# Altium schematic sheet ESP32_AC_Controller.SchDoc
size A3; SheetNumber: 1; SheetTotal: 1
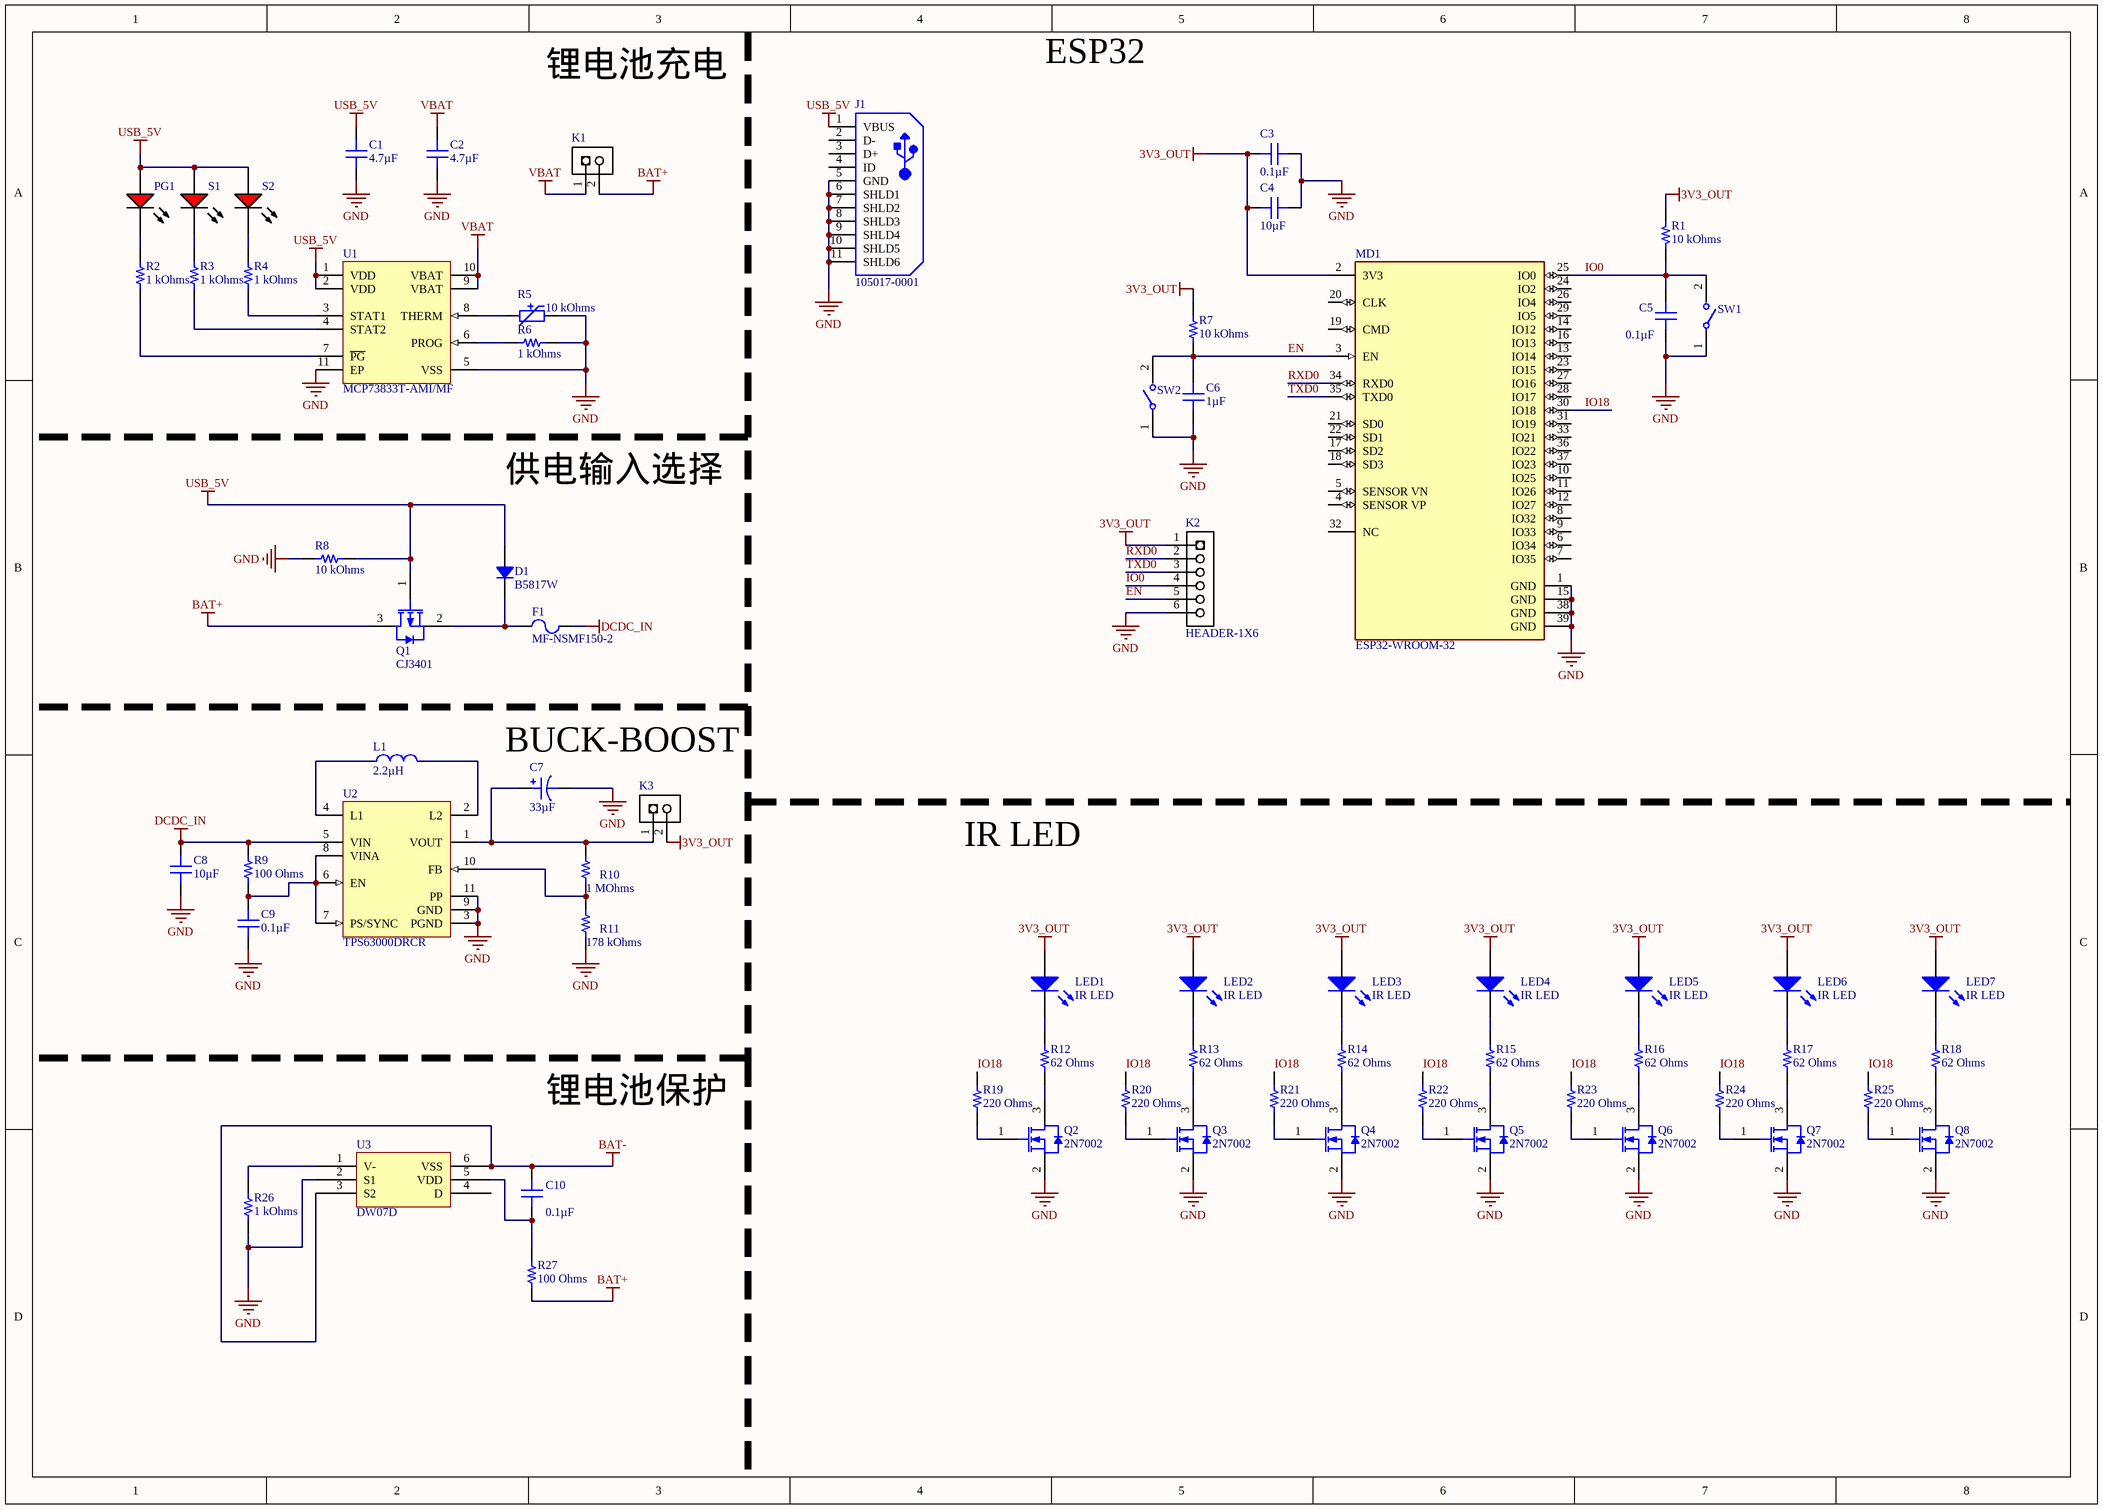
[diagram p0: ESP32_AC_Controller.SchDoc]

## Parts
C1  4.7µF  [CAP 0603_1608]
C2  4.7µF  [CAP 0603_1608]
C3  0.1µF  [CAP 0603_1608]
C4  10µF  [CAP 0603_1608]
C5  0.1µF  [CAP 0603_1608]
C6  1µF  [CAP 0603_1608]
C7  33µF  [CAP POL 1411_3528]
C8  10µF  [CAP 0603_1608]
C9  0.1µF  [CAP 0603_1608]
C10  0.1µF  [CAP 0603_1608]
D1  B5817W  [SOD-123]
F1  MF-NSMF150-2  [BOUR-MF-NSMF150-2_V]
J1  105017-0001  [USB-MICRO-B_V]
K1  HEADER-1X2  [HEADER-1X2]  (value not drawn)
K2  HEADER-1X6  [HEADER-1X6]
K3  HEADER-1X2  [HEADER-1X2]  (value not drawn)
L1  2.2µH  [FP-IHLP-2525CZ-FP_2_413x3-MFG]
LED1  IR LED  [Type 5mm]
LED2  IR LED  [Type 5mm]
LED3  IR LED  [Type 5mm]
LED4  IR LED  [Type 5mm]
LED5  IR LED  [Type 5mm]
LED6  IR LED  [Type 5mm]
LED7  IR LED  [Type 5mm]
MD1  ESP32-WROOM-32  [FP-ESP32-WROOM-32-MFG]
PG1  TLMS1100-GS08  [VISH-TLMX1100_V]  (value not drawn)
Q1  CJ3401  [FAIR-SSOT3L-3_V]
Q2  2N7002  [STM-SOT-23-3_V]
Q3  2N7002  [STM-SOT-23-3_V]
Q4  2N7002  [STM-SOT-23-3_V]
Q5  2N7002  [STM-SOT-23-3_V]
Q6  2N7002  [STM-SOT-23-3_V]
Q7  2N7002  [STM-SOT-23-3_V]
Q8  2N7002  [STM-SOT-23-3_V]
R1  10 kOhms  [RES 0603_1608]
R2  1 kOhms  [RES 0603_1608]
R3  1 kOhms  [RES 0603_1608]
R4  1 kOhms  [RES 0603_1608]
R5  10 kOhms  [PTC 0603_1608]
R6  1 kOhms  [RES 0603_1608]
R7  10 kOhms  [RES 0603_1608]
R8  10 kOhms  [RES 0603_1608]
R9  100 Ohms  [RES 0603_1608]
R10  1 MOhms  [RES 0603_1608]
R11  178 kOhms  [RES 0603_1608]
R12  62 Ohms  [RES 0603_1608]
R13  62 Ohms  [RES 0603_1608]
R14  62 Ohms  [RES 0603_1608]
R15  62 Ohms  [RES 0603_1608]
R16  62 Ohms  [RES 0603_1608]
R17  62 Ohms  [RES 0603_1608]
R18  62 Ohms  [RES 0603_1608]
R19  220 Ohms  [RES 0603_1608]
R20  220 Ohms  [RES 0603_1608]
R21  220 Ohms  [RES 0603_1608]
R22  220 Ohms  [RES 0603_1608]
R23  220 Ohms  [RES 0603_1608]
R24  220 Ohms  [RES 0603_1608]
R25  220 Ohms  [RES 0603_1608]
R26  1 kOhms  [RES 0603_1608]
R27  100 Ohms  [RES 0603_1608]
S1  TLMS1100-GS08  [VISH-TLMX1100_V]  (value not drawn)
S2  TLMS1100-GS08  [VISH-TLMX1100_V]  (value not drawn)
SW1  B3U-1000P  [FP-B3U-1000P-MFG]  (value not drawn)
SW2  B3U-1000P  [FP-B3U-1000P-MFG]  (value not drawn)
U1  MCP73833T-AMI/MF  [DFN-MF10]
U2  TPS63000DRCR  [DRC0010J_V]
U3  DW07D  [DW07D]

## Nets
3V3_OUT: C3.2 C4.1 K2.1 K3.2 LED1.2(A) LED2.2(A) LED3.2(A) LED4.2(A) LED5.2(A) LED6.2(A) LED7.2(A) MD1.2(3V3) R1.2 R7.2
BAT+: K1.2 Q1.3(DRAIN) R27.1
BAT-: C10.1 U3.3(S2) U3.6(VSS)
DCDC_IN: C8.2 F1.2 R9.1 U2.5(VIN)
GND: C1.1 C2.1 C3.1 C4.2 C5.2 C6.1 C7.2 C8.1 C9.2 J1.5(GND) J1.6(SHLD1) J1.7(SHLD2) J1.8(SHLD3) J1.9(SHLD4) J1.10(SHLD5) J1.11(SHLD6) K2.6 MD1.1(GND) MD1.15(GND) MD1.38(GND) MD1.39(GND) Q2.2(S) Q3.2(S) Q4.2(S) Q5.2(S) Q6.2(S) Q7.2(S) Q8.2(S) R5.1 R6.1 R8.2 R11.2 R26.1 SW1.1 SW2.1 U1.5(VSS) U1.11(EP) U2.3(PGND) U2.9(GND) U2.11(PP) U3.2(S1)
USB_5V: C1.2 D1.1 J1.1(VBUS) PG1.1(A) Q1.1(GATE) R8.1 S1.1(A) S2.1(A) U1.1(VDD) U1.2(VDD)
VBAT: C2.2 K1.1 U1.9(VBAT) U1.10(VBAT)
EN: C6.2 K2.5 MD1.3(EN) R7.1 SW2.2
IO0: C5.1 K2.4 MD1.25(IO0) R1.1 SW1.2
IO18: MD1.30(IO18) R19.2 R20.2 R21.2 R22.2 R23.2 R24.2 R25.2
RXD0: K2.2 MD1.34(RXD0)
TXD0: K2.3 MD1.35(TXD0)
NetC7_1: C7.1 K3.1 R10.1 U2.1(VOUT)
NetC9_1: C9.1 R9.2 U2.6(EN) U2.7(PS/SYNC) U2.8(VINA)
NetC10_2: C10.2 R27.2 U3.5(VDD)
NetD1_2: D1.2 F1.1 Q1.2(SOURCE)
NetL1_1: L1.1 U2.4(L1)
NetL1_2: L1.2 U2.2(L2)
NetLED1_1: LED1.1(K) R12.2
NetLED2_1: LED2.1(K) R13.2
NetLED3_1: LED3.1(K) R14.2
NetLED4_1: LED4.1(K) R15.2
NetLED5_1: LED5.1(K) R16.2
NetLED6_1: LED6.1(K) R17.2
NetLED7_1: LED7.1(K) R18.2
NetPG1_2: PG1.2(K) R2.2
NetQ2_1: Q2.1(G) R19.1
NetQ2_3: Q2.3(D) R12.1
NetQ3_1: Q3.1(G) R20.1
NetQ3_3: Q3.3(D) R13.1
NetQ4_1: Q4.1(G) R21.1
NetQ4_3: Q4.3(D) R14.1
NetQ5_1: Q5.1(G) R22.1
NetQ5_3: Q5.3(D) R15.1
NetQ6_1: Q6.1(G) R23.1
NetQ6_3: Q6.3(D) R16.1
NetQ7_1: Q7.1(G) R24.1
NetQ7_3: Q7.3(D) R17.1
NetQ8_1: Q8.1(G) R25.1
NetQ8_3: Q8.3(D) R18.1
NetR2_1: R2.1 U1.7(~{PG})
NetR3_1: R3.1 U1.4(STAT2)
NetR3_2: R3.2 S1.2(K)
NetR4_1: R4.1 U1.3(STAT1)
NetR4_2: R4.2 S2.2(K)
NetR5_2: R5.2 U1.8(THERM)
NetR6_2: R6.2 U1.6(PROG)
NetR10_2: R10.2 R11.1 U2.10(FB)
NetR26_2: R26.2 U3.1(V-)

Not connected (* = marked no-connect by the designer): J1 2(D-) 3(D+) 4(ID); MD1 4(SENSOR_VP) 5(SENSOR_VN) 6(IO34) 7(IO35) 8(IO32) 9(IO33) 10(IO25) 11(IO26) 12(IO27) 13(IO14) 14(IO12) 16(IO13) 17(SD2) 18(SD3) 19(CMD) 20(CLK) 21(SD0) 22(SD1) 23(IO15) 24(IO2) 26(IO4) 27(IO16) 28(IO17) 29(IO5) 31(IO19) 32(NC) 33(IO21) 36(IO22) 37(IO23); U3 4(D)

## Notes on the sheet
- 锂电池充电
- ESP32
- 供电输入选择
- (near C7) BUCK-BOOST
- IR LED
- 锂电池保护

## Library data of the parts
C1 C2 = C0603C105K4RACAUTO: CAP CER 0603 1UF 16V X7R 10%; Manufacturer: KEMET; Capacitance: 1µF; Part Number: C0603C105K4RACAUTO; Value: 4.7µF; Applications: Automotive, Bypass, Decoupling; ComponentLink1Description: Datasheet; ComponentLink1URL: https://api.kemet.com/component-edge/download/datasheet/C0603C105K4RACAUTO.pdf; ComponentLink2Description: DigiKey Link; ComponentLink2URL: http://digikey.com/product-detail/en/kemet/C0603C105K4RACAUTO/399-17704-1-ND/8635855; Device Package: 0603 (1608 Metric); LastUpdated: 2020/9/2 1:03:36; Lifecycle Status: Active; Minimum Order: 1; Mounting Type: Surface Mount, MLCC; Operating Temperature: -55°C ~ 125°C; Package / Case: 0603 (1608 Metric); Packaging: TapeAndReel; PartId: 2179; Part Status: Active; Price: 0.02; Ratings: AEC-Q200; Series: SMD Auto X7R; Size / Dimension: 0.063" L x 0.031" W (1.60mm x 0.80mm); Supplier 1: DigiKey; Supplier Part Number 1: 399-17704-1-ND; Temperature Coefficient: X7R; Thickness (Max): 0.037" (0.95mm); Tolerance: ±10%; Voltage - Rated: 16V
C3 C5 C10 = C0603T104K8RAC7867: CAP CER 0.1UF 10V X7R 0603; Manufacturer: KEMET; Ratings: COTS; Tolerance: ±10%; Part Number: C0603T104K8RAC7867; Value: 0.1µF; Applications: High Reliability, Bypass, Decoupling; Capacitance: 0.1µF; ComponentLink1Description: Datasheet; ComponentLink1URL: https://api.kemet.com/component-edge/download/datasheet/C0603T104K8RAC7867.pdf; ComponentLink2Description: DigiKey Link; ComponentLink2URL: http://digikey.com/product-detail/en/kemet/C0603T104K8RAC7867/399-20424-1-ND/9925028; Device Package: 0603 (1608 Metric); LastUpdated: 2020/9/2 1:03:35; Lifecycle Status: Active; Minimum Order: 1; Mounting Type: Surface Mount, MLCC; Operating Temperature: -55°C ~ 125°C; Package / Case: 0603 (1608 Metric); Packaging: TapeAndReel; PartId: 2528; Part Status: Active; Price: 0.23; Series: SMD COTS X7R; Size / Dimension: 0.063" L x 0.031" W (1.60mm x 0.80mm); Supplier 1: DigiKey; Supplier Part Number 1: 399-20424-1-ND; Temperature Coefficient: X7R; Thickness (Max): 0.034" (0.87mm); Voltage - Rated: 10V
C4 = GRM188R61A106MAALD: CAP CER 10UF 10V X5R 0603; Manufacturer: Murata Electronics; Tolerance: ±20%; Part Number: GRM188R61A106MAALD; Value: 10µF; Applications: General Purpose; Capacitance: 10µF; ComponentLink1Description: Datasheet; ComponentLink1URL: https://search.murata.co.jp/Ceramy/image/img/A01X/G101/ENG/GRM188R61A106MAAL-01.pdf; ComponentLink2Description: DigiKey Link; ComponentLink2URL: http://digikey.com/product-detail/en/murata-electronics/GRM188R61A106MAALD/490-12734-1-ND/5797703; Device Package: 0603 (1608 Metric); LastUpdated: 2020/9/2 1:03:35; Lifecycle Status: Active; Minimum Order: 1; Mounting Type: Surface Mount, MLCC; Operating Temperature: -55°C ~ 85°C; Package / Case: 0603 (1608 Metric); Packaging: TapeAndReel; PartId: 2423; Part Status: Active; Price: 0.08; Series: GRM; Size / Dimension: 0.063" L x 0.031" W (1.60mm x 0.80mm); Supplier 1: DigiKey; Supplier Part Number 1: 490-12734-1-ND; Temperature Coefficient: X5R; Thickness (Max): 0.037" (0.95mm); Voltage - Rated: 10V
C6 = CC0603KRX7R6BB105: CAP CER 1UF 10V X7R 0603; Manufacturer: Yageo; Tolerance: ±10%; Part Number: CC0603KRX7R6BB105; Value: 1µF; Applications: General Purpose; Capacitance: 1µF; ComponentLink1Description: Datasheet; ComponentLink1URL: https://www.yageo.com/upload/media/product/productsearch/datasheet/mlcc/UPY-GPHC_X7R_6.3V-to-50V_18.pdf; ComponentLink2Description: DigiKey Link; ComponentLink2URL: http://digikey.com/product-detail/en/yageo/CC0603KRX7R6BB105/311-1796-1-ND/5195698; Device Package: 0603 (1608 Metric); LastUpdated: 2020/9/2 1:03:36; Lifecycle Status: Active; Minimum Order: 1; Mounting Type: Surface Mount, MLCC; Operating Temperature: -55°C ~ 125°C; Package / Case: 0603 (1608 Metric); Packaging: TapeAndReel; PartId: 2290; Part Status: Active; Price: 0.02; Series: CC; Size / Dimension: 0.063" L x 0.031" W (1.60mm x 0.80mm); Supplier 1: DigiKey; Supplier Part Number 1: 311-1796-1-ND; Temperature Coefficient: X7R; Thickness (Max): 0.035" (0.90mm); Voltage - Rated: 10V
C7 = CWR11MH105KB: CAP TANT 1UF 10% 35V 1411; Manufacturer: KEMET; Manufacturer Size Code: B; Capacitance: 1µF; ESR (Equivalent Series Resistance): 6.5Ohm; Type: Molded; Part Number: CWR11MH105KB; Value: 33µF; ComponentLink1Description: Datasheet; ComponentLink1URL: https://api.kemet.com/component-edge/download/datasheet/CWR11MH105KB.pdf; ComponentLink2Description: DigiKey Link; ComponentLink2URL: http://digikey.com/product-detail/en/kemet/CWR11MH105KB/1001-2230-1-ND/3317720; Device Package: 1411 (3528 Metric); Failure Rate: B (0.1%); Features: High Reliability; Height - Seated (Max): 0.083" (2.10mm); LastUpdated: 2020/9/2 1:15:46; Lifecycle Status: Active; Minimum Order: 1; Mounting Type: Surface Mount; Operating Temperature: -55°C ~ 125°C; Package / Case: 1411 (3528 Metric); Packaging: TapeAndReel; PartId: 1; Part Status: Active; Price: 1.20; Series: Military, MIL-PRF-55365/8, CWR11; Size / Dimension: 0.138" L x 0.110" W (3.50mm x 2.80mm); Supplier 1: DigiKey; Supplier Part Number 1: 1001-2230-1-ND; Tolerance: ±10%; Voltage - Rated: 35V
C8 = GRM188R60J106ME47D: CAP CER 10UF 6.3V X5R 0603; Manufacturer: Murata Electronics; Tolerance: ±20%; Part Number: GRM188R60J106ME47D; Value: 10µF; Applications: General Purpose; Capacitance: 10µF; ComponentLink1Description: Datasheet; ComponentLink1URL: https://www.murata.com/~/media/webrenewal/support/library/catalog/products/capacitor/mlcc/c02e.ashx?la=en-us; ComponentLink2Description: DigiKey Link; ComponentLink2URL: http://digikey.com/product-detail/en/murata-electronics/GRM188R60J106ME47D/490-3896-1-ND/965938; Device Package: 0603 (1608 Metric); LastUpdated: 2020/9/2 1:03:35; Lifecycle Status: Active; Minimum Order: 1; Mounting Type: Surface Mount, MLCC; Operating Temperature: -55°C ~ 85°C; Package / Case: 0603 (1608 Metric); Packaging: TapeAndReel; PartId: 2351; Part Status: Active; Price: 0.03; Series: GRM; Size / Dimension: 0.063" L x 0.031" W (1.60mm x 0.80mm); Supplier 1: DigiKey; Supplier Part Number 1: 490-3896-1-ND; Temperature Coefficient: X5R; Thickness (Max): 0.035" (0.90mm); Voltage - Rated: 6.3V
C9 = GRM188R60J106ME47D: CAP CER 10UF 6.3V X5R 0603; Manufacturer: Murata Electronics; Capacitance: 10µF; Tolerance: ±20%; Part Number: GRM188R60J106ME47D; Value: 0.1µF; Applications: General Purpose; ComponentLink1Description: Datasheet; ComponentLink1URL: https://www.murata.com/~/media/webrenewal/support/library/catalog/products/capacitor/mlcc/c02e.ashx?la=en-us; ComponentLink2Description: DigiKey Link; ComponentLink2URL: http://digikey.com/product-detail/en/murata-electronics/GRM188R60J106ME47D/490-3896-1-ND/965938; Device Package: 0603 (1608 Metric); LastUpdated: 2020/9/2 1:03:35; Lifecycle Status: Active; Minimum Order: 1; Mounting Type: Surface Mount, MLCC; Operating Temperature: -55°C ~ 85°C; Package / Case: 0603 (1608 Metric); Packaging: TapeAndReel; PartId: 2351; Part Status: Active; Price: 0.03; Series: GRM; Size / Dimension: 0.063" L x 0.031" W (1.60mm x 0.80mm); Supplier 1: DigiKey; Supplier Part Number 1: 490-3896-1-ND; Temperature Coefficient: X5R; Thickness (Max): 0.035" (0.90mm); Voltage - Rated: 6.3V
D1 = B5818W-TP: DIODE SCHOTTKY 30V 1A SOD-123; Manufacturer: Micro Commercial Co; Capacitance @ Vr, F: 120pF @ 4V, 1MHz; Current - Reverse Leakage @ Vr: 1mA @ 30V; Speed: Fast Recovery =< 500ns, > 200mA (Io); Voltage - Forward (Vf) (Max) @ If: 550mV @ 1A; Part Number: B5818W-TP; ComponentLink1Description: Datasheet; ComponentLink1URL: https://www.mccsemi.com/pdf/Products/B5817W-B5819W(SOD-123).pdf; ComponentLink2Description: DigiKey Link; ComponentLink2URL: http://digikey.com/product-detail/en/micro-commercial-co/B5818W-TP/B5818W-TPMSCT-ND/10054446; Current - Average Rectified (Io): 1A; Diode Type: Schottky; LastUpdated: 2020/9/2 1:19:07; Lifecycle Status: Active; Minimum Order: 1; Mounting Type: Surface Mount; Operating Temperature - Junction: -65°C ~ 125°C; Package / Case: SOD-123; Packaging: TapeAndReel; PartId: 2247; Part Status: Active; Price: 0.08; Series: -; Supplier 1: DigiKey; Supplier Part Number 1: B5818W-TPMSCT-ND; Supplier Device Package: SOD-123; Voltage - DC Reverse (Vr) (Max): 30V
F1 = CMP-2000-06693-1: PTC Resettable Fuse, 6 V, 100 A, -40 to 85 degC, 2-Pin SMD, RoHS, Tape and Reel; Manufacturer: Bourns; Trip Current: 3A; Maximum Voltage DC: 6V; Current Rating: 100A; Resistance: 130mOhms; Type: PTCResettableFuses; Hold Current: 1.5A; Maximum Voltage: 6VDC; RoHS: Details; Current Rating (Max): 100A; Datasheet URL: http://www.bourns.com/docs/Product-Datasheets/mfnsmf.pdf; Package Description: 2-Pin Surface Mount Device, Body 3.2 x 1.6 mm; Series: MF-NSMF; Mounting Technology: SurfaceMount; Dimensions: 3.4mmLx1.8mmWx0.7mmH; Termination Style: SMD/SMT; Datasheet Version: Rev. T, 08/2015; Package / Case: 1206(3216metric); Manufacturer URL: http://www.bourns.com/; Product Category: ResettableFuses-PPTC; Packaging: Reel; Brand: Bourns; Mounting Style: SMD/SMT; Package Reference: MF-NSMF150-2; Current Rating - Max: 100A; Tradename: Multifuse; Factory Pack Quantity: 3000; Operating Temperature Range: -40Cto+85C
J1 = CMP-2000-05827-1: Micro-USB B Receptacle, Right Angle, Bottom Mount, Surface Mount, with Solder Tabs, -30 to 85 degC, 5-Pin USB, RoHS, Tape and Reel; Manufacturer: Molex; Featured Product: Micro-USBConnectorsUSBConnectors; Other Names: WM1399DKR; Package Version: Rev. F, 12/2012; Number of Contacts: 5; Connector Type: USB-microB; Catalog Drawings: 1050170001; 3D Model: 105017-0001.stp; Mating Products: WM17145-ND-CABLEMICROUSBBTOSTDA1.0MWM17147-ND-CABLEMICROUSBBTOSTDA2.0MWM17146-ND-CABLEMICROUSBBTOSTDA1.5M; PCN Assembly/Origin: ResinSupplier21/Oct/2015; Voltage - Max: 30V; Online Catalog: Molex-MicroUSB; Manufacturer URL: http://www.molex.com/; Package Description: 5-Leads USB, Micro B, Body 7.5 x 5 mm, Pitch 0.65 mm; Datasheet URL: http://www.molex.com/elqNow/elqRedir.htm?ref=http://www.molex.com/webdocs/datasheets/pdf/en-us/1050170001_IO_CONNECTORS.pdf; Ingress Protection: -; Datasheet Version: 03/2016; Mounting Type: BoardCutout,SurfaceMount,RightAngle; Circuits: 5; Standard Package: 1; Package Reference: MICRO-B; Package URL: http://www.molex.com/pdm_docs/sd/1050170001_sd.pdf; Category: Connectors,Interconnects; Series: -; RoHS Information: 1050170001CertofCompliance; Features: Shielded,SolderRetention; Family: USB,DVI,HDMIConnectors; Specifications: -; Gender: Receptacle; Packaging: Digi-Reel®; Mounting Technology: SurfaceMount
K1 K3 = HEADER-1X2: REEL: TH; Supplier 1: Digi-Key; Supplier Part Number 1: S1011E-36-ND
L1 = CMP-02424-000104-1: Commercial Inductors, High Saturation Series 6.8uH 4.5A 60mΩ 20%; Saturation Current: 8A; Self Resonant Frequency: 5MHz; Core Material: Metal; DC Resistance (DCR): 60mR; Test Frequency: 100kHz; Shielding: Shielded; Number of Pins: 2; Tolerance: 20%; Max DC Current: 8A; Max Operating Temperature: 125°C; Radiation Hardening: No; Inductance: 6.8uH; Contact Plating: Tin; RMS Current (Irms): 4.5A; Case/Package: 2525; Inductance Tolerance: 20%; Case Code (Metric): 6363; Lead Free: Lead Free; Package Quantity: 2000; Current Rating: 4.5A; Case Code (Imperial): 2525; Height - Seated (Max): 0.118inch; Height: 3mm; Mount: Surface Mount; Depth: 6.72mm; Military Standard: Not; Packaging: Tape and Reel; Min Operating Temperature: -55°C; Width: 0.255inch; Length: 7.24mm; Termination: SMD/SMT
LED1-LED7 = CMP-1489-00006-1: THT LED round mono-color waterclear, WL-TMRW ,Blue; Manufacturer: Wuerth Elektronik; PartNumber: 151053BS04500; ComponentLink1URL: http://www.we-online.com; ComponentLink2URL: http://katalog.we-online.de/pbs/datasheet/7448042001.pdfhttp://katalog.we-online.de/pbs/datasheet/7448042001.pdfhttp://katalog.we-online.de/pbs/datasheet/7448042001.pdfhttp://katalog.we-online.de/pbs/datasheet/151053BS04500.pdf; PackageReference: Type 5mm; ComponentLink1Description: Manufacturer URL; Emitting color: Blue; ComponentLink2Description: Datasheet
MD1 = CMP-194065-000008-1: RX TXRX MOD WIFI SURFACE MOUNT; Frequency: 2.5GHz; Sensitivity: -98dBm; Operating Supply Voltage: 3.6V; Data Rate: 150Mbps; Weight: 0.088185oz; Package Quantity: 550; Min Operating Temperature: -40°C; Mount: Surface Mount; Max Operating Temperature: 85°C; Packaging: Cut Tape; Case/Package: SMD/SMT
PG1 S1 S2 = CMP-1666-00027-1: LED, RED, 2.1 V, -40 to 100 degC, 2-Pin SMD (0603), RoHS, Tape and Reel; Type (Capacitors): C0G; Resistance: 100000000000 Ohm; Capacitance: 12 pF; Voltage Rating: 50 V; Tolerance: 5%; Min Operating Temperature: -55degC; REACH SVHC: No SVHC; ComponentLink2Description: Datasheet; ComponentLink1URL: http://www.vishay.com/; Width: 0.8 mm; Package Quantity: 4000; PackageReference: TLMX1100; ComponentLink2URL: http://www.vishay.com/docs/83173/tlmb1100.pdf; Case/Package: 0603; Case Code (Metric): 1608; Packaging: Tape and Reel; Pins: 2; ComponentLink1Description: Manufacturer URL; Max Operating Temperature: 125degC; Height: 0.8 mm; Length: 1.6 mm; Mount: Surface Mount; PackageDescription: 2-Pin Surface Mount Device, Body 1.6 x 0.8 mm; DatasheetVersion: Rev. 2.7, 03/2016; Case Code (Imperial): 0603; Voltage Rating (DC): 50 V; RoHSCompliant: True; Radiation Hardening: No
Q1 = CMP-2000-06247-1: P-Channel Specified Power Trench(R) MOSFET, 1.8 V, -55 to 150 degC, 3-Pin SSOT, RoHS, Tape and Reel; Manufacturer: Fairchild Semiconductor; Reel Quantity: 3000; Drain Source Voltage Vds: 20V; Power Dissipation Pd: 500mW; On Resistance Rds(on): 52mohm; Full Power Rating Temperature: 25°C; Voltage Vgs Max: -800mV; Pulse Current Idm: 10A; Rds(on) Test Voltage Vgs: -4.5V; External Depth: 2.5mm; Transistor Case Style: SOT-23; No. of Pins: 3; Continuous Drain Current Id: 2.4A; Voltage Vds Typ: -20V; Voltage Vgs th Max: -1.5V; Transistor Polarity: PChannel; Package Version: Rev. 3, 05/2015; External Width: 3.05mm; External Length / Height: 1.12mm; SMD Marking: 304P; SVHC: NoSVHC(19-Dec-2012); Termination Type: SMD; Datasheet URL: https://www.fairchildsemi.com/datasheets/FD/FDN304P.pdf; Tape Width: 8mm; Mounting Technology: SurfaceMount; Voltage Vgs Rds on Measurement: -4.5V; Operating Temperature Range: -55°Cto+150°C; Current Temperature: 25°C; Operating Temperature Min: -55°C; Threshold Voltage Vgs Typ: -800mV; Package / Case: SOT-23; Manufacturer URL: https://www.fairchildsemi.com/; Voltage Vds: 20V; Datasheet Version: Rev. C, 01/2001; Operating Temperature Max: 150°C; Package Description: 3-Pin Small Outline Transistor, Body 2.92 x 1.4 mm, Pitch 0.95 mm; Current Id Max: 2.4A; Package URL: https://www.fairchildsemi.com/package-drawings/MA/MA03B.pdf; Package Reference: SSOT3L
Q2-Q8 = CMP-0434-00001-1: N-channel 60 V, 1.8 Ohm, 0.35 A STripFET(TM) II Power MOSFET, SOT23; Manufacturer: STMicroelectronics; PartNumber: 2N7002; ComponentLink2Description: Datasheet; ComponentLink2URL: http://www.st.com/st-web-ui/static/active/en/resource/technical/document/datasheet/CD00005134.pdf; ComponentLink1Description: Manufacturer URL; ComponentLink1URL: http://www.st.com/; DatasheetVersion: Rev. 9, 11/2008; PackageReference: SOT-23; Mounting Technology: Surface Mount; PackageDescription: 3-Pin SOT23, 3.016 x 2.8 mm Body, 0.95 mm Pitch
R1 R6-R8 = RNCS0603BKE10K0: RES 10K OHM 0.1% 1/16W 0603; Manufacturer: Stackpole Electronics Inc; Power (Watts): 0.063W, 1/16W; Temperature Coefficient: ±25ppm/°C; Part Number: RNCS0603BKE10K0; ComponentLink1Description: Datasheet; ComponentLink1URL: https://www.seielect.com/catalog/sei-rncs_rnch.pdf; ComponentLink2Description: DigiKey Link; ComponentLink2URL: http://digikey.com/product-detail/en/stackpole-electronics-inc/RNCS0603BKE10K0/RNCS0603BKE10K0CT-ND/1800113; Composition: Thin Film; Device Package: 0603 (1608 Metric); Features: Anti-Corrosive, Automotive AEC-Q200, Moisture Resistant; Height - Seated (Max): 0.022" (0.55mm); LastUpdated: 2020/9/2 1:10:25; Lifecycle Status: Active; Minimum Order: 1; Number of Terminations: 2; Operating Temperature: -55°C ~ 155°C; Package / Case: 0603 (1608 Metric); Packaging: TapeAndReel; PartId: 4838; Part Status: Active; Price: 0.08; Ratings: AEC-Q200; Series: RNCS; Size / Dimension: 0.061" L x 0.031" W (1.55mm x 0.80mm); Supplier 1: DigiKey; Supplier Part Number 1: RNCS0603BKE10K0CT-ND; Supplier Device Package: 0603; Tolerance: ±0.1%
  R1 R7 R8: Value: 10 kOhms; Resistance: 10 kOhms
  R6: Value: 1 kOhms; Resistance: 1 kOhms
R2-R4 R9-R11 = RNCS0603BKE10K0: RES 10K OHM 0.1% 1/16W 0603; Manufacturer: Stackpole Electronics Inc; Power (Watts): 0.063W, 1/16W; Resistance: 10 kOhms; Temperature Coefficient: ±25ppm/°C; Part Number: RNCS0603BKE10K0; ComponentLink1Description: Datasheet; ComponentLink1URL: https://www.seielect.com/catalog/sei-rncs_rnch.pdf; ComponentLink2Description: DigiKey Link; ComponentLink2URL: http://digikey.com/product-detail/en/stackpole-electronics-inc/RNCS0603BKE10K0/RNCS0603BKE10K0CT-ND/1800113; Composition: Thin Film; Device Package: 0603 (1608 Metric); Features: Anti-Corrosive, Automotive AEC-Q200, Moisture Resistant; Height - Seated (Max): 0.022" (0.55mm); LastUpdated: 2020/9/2 1:10:25; Lifecycle Status: Active; Minimum Order: 1; Number of Terminations: 2; Operating Temperature: -55°C ~ 155°C; Package / Case: 0603 (1608 Metric); Packaging: TapeAndReel; PartId: 4838; Part Status: Active; Price: 0.08; Ratings: AEC-Q200; Series: RNCS; Size / Dimension: 0.061" L x 0.031" W (1.55mm x 0.80mm); Supplier 1: DigiKey; Supplier Part Number 1: RNCS0603BKE10K0CT-ND; Supplier Device Package: 0603; Tolerance: ±0.1%
  R2-R4: Value: 1 kOhms
  R9: Value: 100 Ohms
  R10: Value: 1 MOhms
  R11: Value: 178 kOhms
R5 = B59641A0145A062: THERMISTOR PTC 470 OHM 50% 0603; Manufacturer: TDK Electronics Inc.; Resistance @ 25°C: 470 Ohms; Value: 470 Ohms; Part Number: B59641A0145A062; ComponentLink1Description: Datasheet; ComponentLink1URL: https://www.tdk-electronics.tdk.com/inf/55/db/PTC/PTC_Sensors_SMD_chips_superior.pdf; ComponentLink2Description: DigiKey Link; ComponentLink2URL: http://digikey.com/product-detail/en/tdk-electronics-inc/B59641A0145A062/495-4309-1-ND/2273341; Device Package: 0603 (1608 Metric); LastUpdated: 2020/9/2 1:30:58; Lifecycle Status: Active; Minimum Order: 1; Mounting Type: Surface Mount; Operating Temperature: -40°C ~ 125°C; Package / Case: 0603 (1608 Metric); Packaging: TapeAndReel; Part Status: Active; Price: 0.18; Resistance Tolerance: ±50%; Series: Automotive, AEC-Q200, B59641; Supplier 1: DigiKey; Supplier Part Number 1: 495-4309-1-ND; Supplier Device Package: 0603
R12-R18 = SDR03EZPF62R0: RES SMD 62 OHM 1% 0.3W 0603; Manufacturer: Rohm Semiconductor; Temperature Coefficient: ±100ppm/°C; Part Number: SDR03EZPF62R0; Value: 62 Ohms; ComponentLink1Description: Datasheet; ComponentLink1URL: https://www.rohm.com/datasheet/SDR03EZPF/sdr-e; ComponentLink2Description: DigiKey Link; ComponentLink2URL: http://digikey.com/product-detail/en/rohm-semiconductor/SDR03EZPF62R0/511-1725-1-ND/9675076; Composition: Thick Film; Device Package: 0603 (1608 Metric); Features: Pulse Withstanding; Height - Seated (Max): 0.022" (0.55mm); LastUpdated: 2020/9/2 1:10:24; Lifecycle Status: Active; Minimum Order: 1; Number of Terminations: 2; Operating Temperature: -55°C ~ 155°C; Package / Case: 0603 (1608 Metric); Packaging: TapeAndReel; PartId: 5389; Part Status: Active; Power (Watts): 0.3W; Price: 0.01; Resistance: 62 Ohms; Series: SDR03; Size / Dimension: 0.063" L x 0.031" W (1.60mm x 0.80mm); Supplier 1: DigiKey; Supplier Part Number 1: 511-1725-1-ND; Supplier Device Package: 0603; Tolerance: ±1%
R19-R25 = CPF0603B220RE1: RES SMD 220 OHM 0.1% 1/16W 0603; Manufacturer: TE Connectivity Passive Product; Power (Watts): 0.063W, 1/16W; Temperature Coefficient: ±25ppm/°C; Part Number: CPF0603B220RE1; Value: 220 Ohms; ComponentLink1Description: Datasheet; ComponentLink1URL: https://www.te.com/commerce/DocumentDelivery/DDEController?Action=srchrtrv&DocNm=1773200&DocType=DS&DocLang=English; ComponentLink2Description: DigiKey Link; ComponentLink2URL: http://digikey.com/product-detail/en/te-connectivity-passive-product/CPF0603B220RE1/A103065CT-ND/2728616; Composition: Thin Film; Device Package: 0603 (1608 Metric); Height - Seated (Max): 0.022" (0.55mm); LastUpdated: 2020/9/2 1:10:23; Lifecycle Status: Active; Minimum Order: 1; Number of Terminations: 2; Operating Temperature: -55°C ~ 155°C; Package / Case: 0603 (1608 Metric); Packaging: TapeAndReel; PartId: 5753; Part Status: Active; Price: 0.12; Resistance: 220 Ohms; Series: CPF, Neohm; Size / Dimension: 0.061" L x 0.031" W (1.55mm x 0.80mm); Supplier 1: DigiKey; Supplier Part Number 1: A103065CT-ND; Supplier Device Package: 0603; Tolerance: ±0.1%
R26 = AC0603FR-071KL: RES SMD 1K OHM 1% 1/10W 0603; Manufacturer: Yageo; Power (Watts): 0.1W, 1/10W; Temperature Coefficient: ±100ppm/°C; Part Number: AC0603FR-071KL; Value: 1 kOhms; ComponentLink1Description: Datasheet; ComponentLink1URL: https://www.yageo.com/upload/media/product/productsearch/datasheet/rchip/PYu-AC_51_RoHS_L_7.pdf; ComponentLink2Description: DigiKey Link; ComponentLink2URL: http://digikey.com/product-detail/en/yageo/AC0603FR-071KL/311-1KLDCT-ND/2828140; Composition: Thick Film; Device Package: 0603 (1608 Metric); Features: Automotive AEC-Q200, Moisture Resistant; Height - Seated (Max): 0.022" (0.55mm); LastUpdated: 2020/9/2 1:09:58; Lifecycle Status: Active; Minimum Order: 1; Number of Terminations: 2; Operating Temperature: -55°C ~ 155°C; Package / Case: 0603 (1608 Metric); Packaging: CutTape; PartId: 17353; Part Status: Active; Price: 0.10; Ratings: AEC-Q200; Resistance: 1 kOhms; Series: AC; Size / Dimension: 0.063" L x 0.031" W (1.60mm x 0.80mm); Supplier 1: DigiKey; Supplier Part Number 1: 311-1KLDCT-ND; Supplier Device Package: 0603; Tolerance: ±1%
R27 = AC0603FR-07100RL: RES SMD 100 OHM 1% 1/10W 0603; Manufacturer: Yageo; Power (Watts): 0.1W, 1/10W; Temperature Coefficient: ±100ppm/°C; Part Number: AC0603FR-07100RL; Value: 100 Ohms; ComponentLink1Description: Datasheet; ComponentLink1URL: https://www.yageo.com/upload/media/product/productsearch/datasheet/rchip/PYu-AC_51_RoHS_L_7.pdf; ComponentLink2Description: DigiKey Link; ComponentLink2URL: http://digikey.com/product-detail/en/yageo/AC0603FR-07100RL/YAG3561CT-ND/6006410; Composition: Thick Film; Device Package: 0603 (1608 Metric); Features: Automotive AEC-Q200, Moisture Resistant; Height - Seated (Max): 0.022" (0.55mm); LastUpdated: 2020/9/2 1:09:58; Lifecycle Status: Active; Minimum Order: 1; Number of Terminations: 2; Operating Temperature: -55°C ~ 155°C; Package / Case: 0603 (1608 Metric); Packaging: CutTape; PartId: 17348; Part Status: Active; Price: 0.10; Ratings: AEC-Q200; Resistance: 100 Ohms; Series: AC; Size / Dimension: 0.063" L x 0.031" W (1.60mm x 0.80mm); Supplier 1: DigiKey; Supplier Part Number 1: YAG3561CT-ND; Supplier Device Package: 0603; Tolerance: ±1%
SW1 SW2 = CMP-2100-03586-2: SWITCH TACTILE SPST-NO 0.05A 12V; Contact Resistance: 100mR; Operating Force: 1.5N; Max Current Rating: 50mA; Switch Travel: 0.15mm; Actuator Type: Standard; Mechanical Life: 200000Cycles; Ratings: Dust Proof; Illumination Type: Non-Illuminated; Throw Configuration: SPST; Actuator Length: 0.4mm; Switch Function: Off-Mom; Height: 1.2mm; Width: 3mm; Weight: 0.000776oz; Contact Material: Silver; Max Voltage Rating (DC): 12V; Insulation Resistance: 100MR; Lead Free: Lead Free; Current Rating: 50mA; Termination: SMD/SMT; Length: 4mm; Voltage Rating (DC): 12V; Contact Current Rating: 50mA; Orientation: Straight; Depth: 2.5mm; Max Operating Temperature: 70°C; Packaging: Tape and Reel; Min Operating Temperature: -25°C; Package Quantity: 1; Mount: Surface Mount; Electrical Life: 200000Cycles
U1 = CMP-0133-00083-1: Stand-Alone Linear Li-Ion/Li-Polymer Charge Management Controller with Power-Good Output, 4.2V, 10-Pin DFN, Industrial Temperature, Tape and Reel; PackageVersion: revBB, Aug-2009; PackageDescription: 10-Lead Plastic Dual Flat, No Lead Package (MF) - 3x3x0.9mm Body [DFN]; PackageReference: DFN-MF10; DatasheetVersion: revB, May-2009
U2 = CMP-0345-00001-2: Buck-Boost Voltage Converter with 1.8 to 5.5 V Input and 1.2 to 5.5 V Output, -40 to 85 degC, 10-Pin SON (DRC), Green (RoHS & no Sb/Br); Manufacturer: Texas Instruments; Vout(Max)(V): 5.5; Synchronous Rectification: TRUE; SubFamily: Buck-Boost Regulator; Vin(Min)(V): 1.8; Iq(Typ)(mA): 0.04; Iout(Max)(A): 1.2; Regulated Outputs(#): 1; Switching Frequency(Max)(kHz): 1500; ComponentLink1Description: Datasheet; Mounting Technology: Surface Mount; DatasheetVersion: SLVS520B; Eco-Plan: Green (RoHS & no Sb/Br); PackageVersion: revL, Sep-2011; PackageDescription: 10-Pin Plastic Small Outline No-Lead, 3 x 3 x 1 mm Body, 0.5 mm Pitch, Exposed Pad; Vout(Min)(V): 1.2; Vin(Max)(V): 5.5; Topology: Buck-Boost; Dynamic Voltage Scaling: TRUE; ComponentLink1URL: http://www.ti.com/general/docs/lit/getliterature.tsp?genericPartNumber=TPS63000&fileType=pdf; PartNumber: TPS63000DRCR; ComponentLink2URL: http://www.ti.com/litv/pdf/mpds117k; PackageReference: DRC0010J; ComponentLink2Description: Package Specification
U3 = DW07D: 锂电池保护IC
K2 = HEADER-1X6: Supplier 1: Digi-Key; Supplier Part Number 1: S1011E-36-ND